# EAGLE design main v0.04 (EAGLE 6.3)
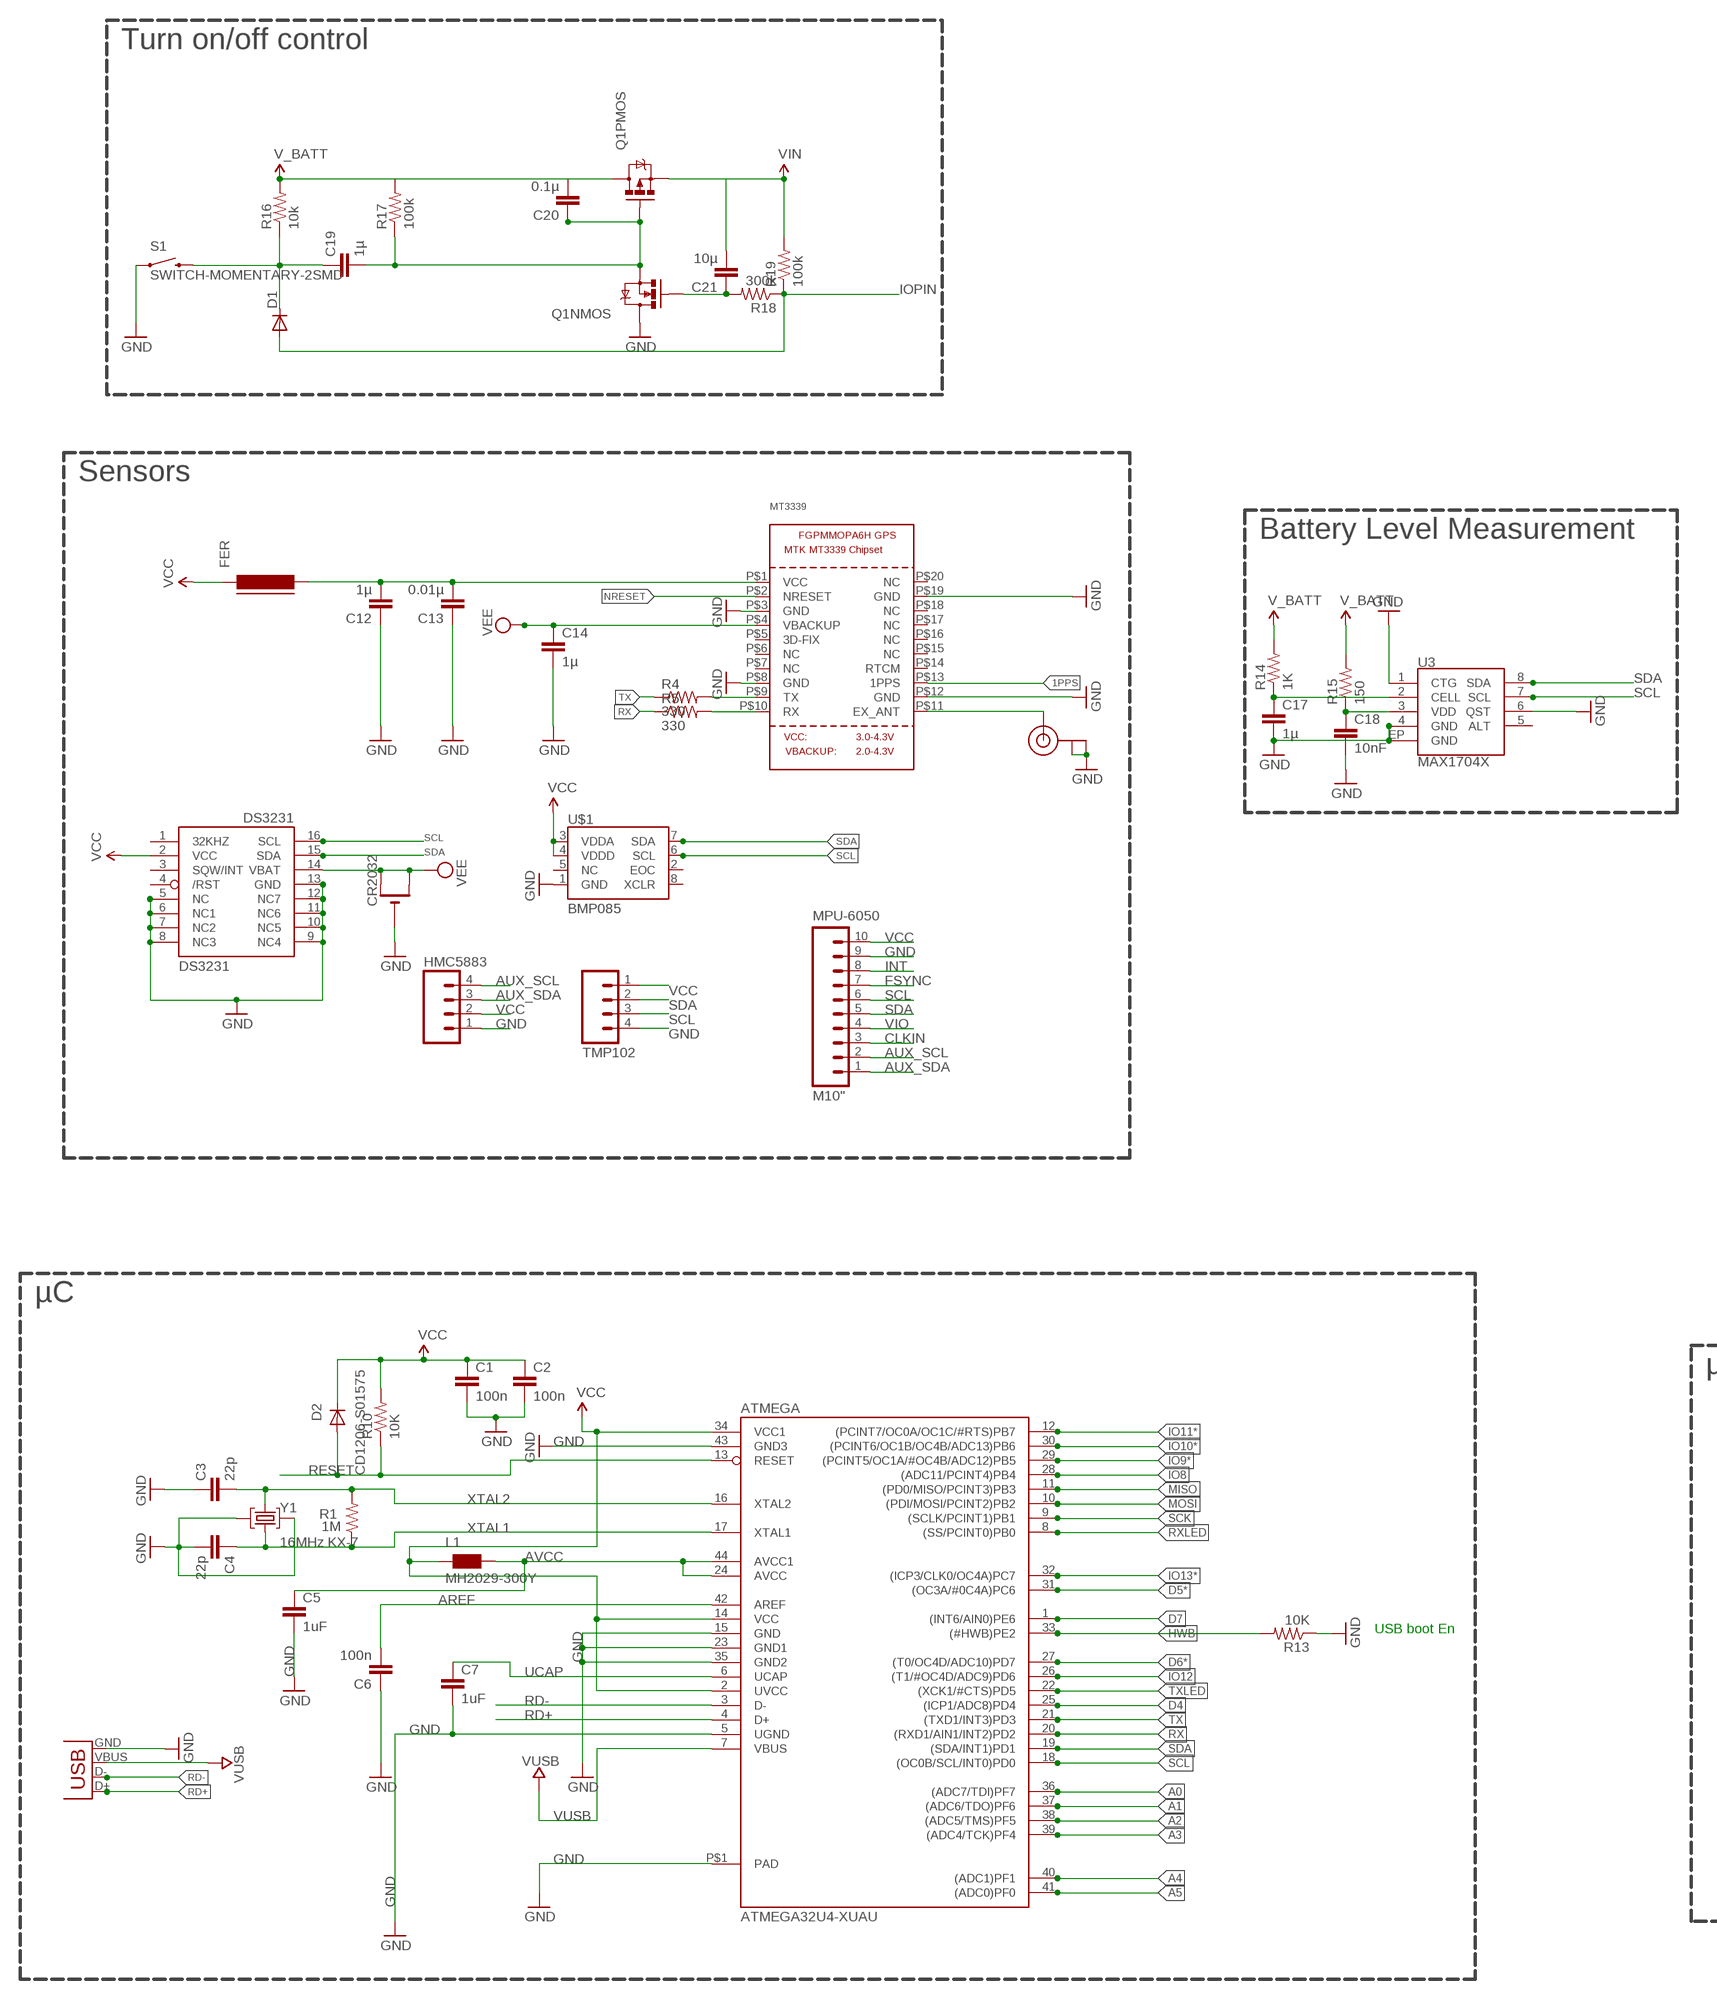
[diagram p0: schematic, sheet 1, part 1 of 2]
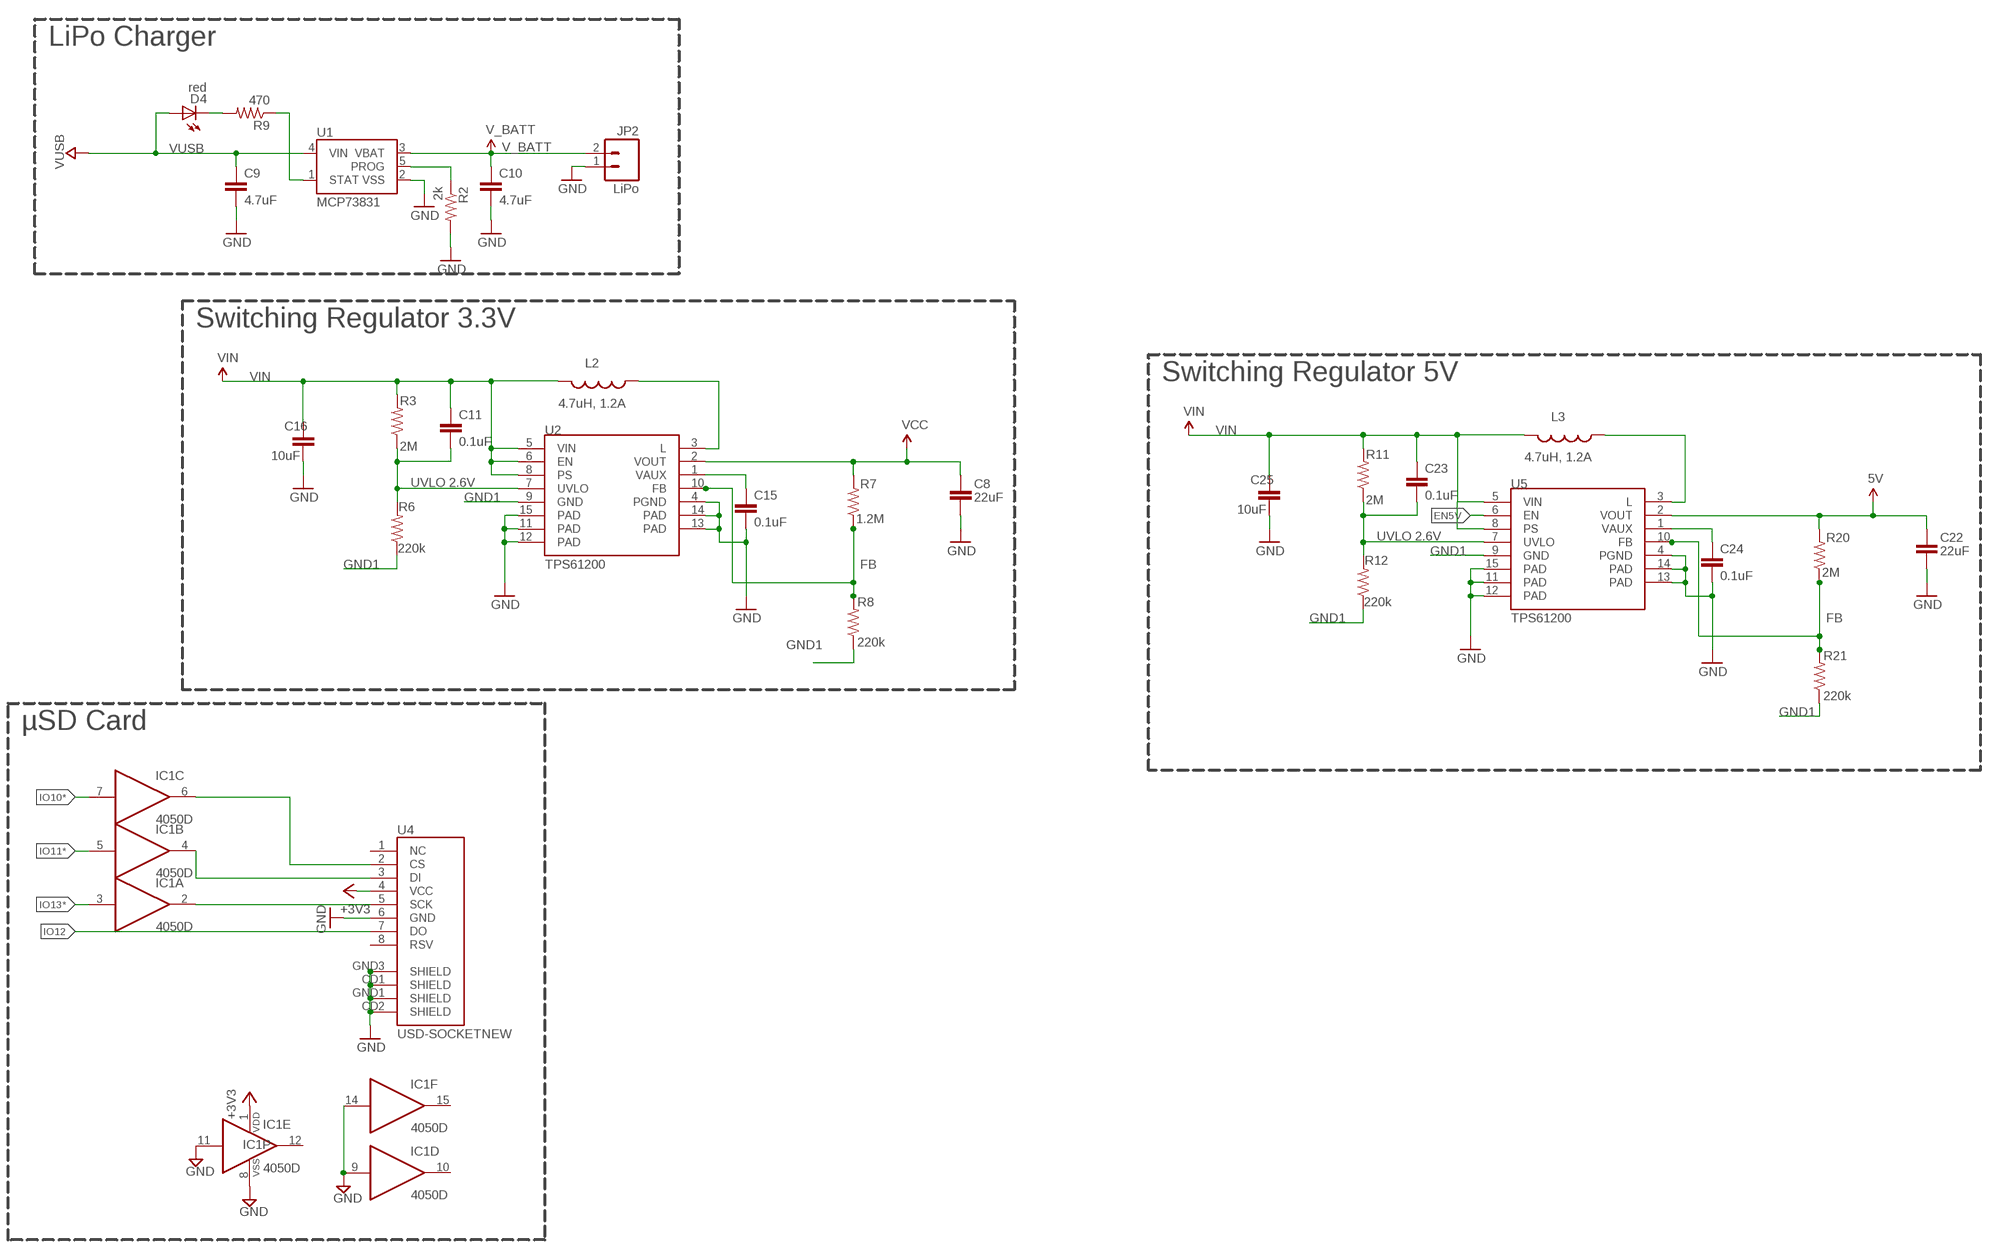
[diagram p1: schematic, sheet 1, part 2 of 2]

## Parts
ATMEGA  ATMEGA32U4-XUAU  [TQFP44-PAD]
C1  100n  CAP0805  [0805]
C2  100n  CAP0805  [0805]
C3  22p  CAP0805  [0805]
C4  22p  CAP0805  [0805]
C5  1uF  CAP0805  [0805]
C6  100n  CAP0805  [0805]
C7  1uF  CAP0805  [0805]
C8  22uF  CAP0805  [0805]
C9  4.7uF  CAP0805  [0805]
C10  4.7uF  CAP0805  [0805]
C11  0.1uF  CAP0805  [0805]
C12  1µ  CAP0805  [0805]
C13  0.01µ  CAP0805  [0805]
C14  1µ  CAP0805  [0805]
C15  0.1uF  CAP0805  [0805]
C16  10uF  CAP0805  [0805]
C17  1µ  CAP0805  [0805]
C18  10nF  CAP0805  [0805]
C19  1µ  CAP0805  [0805]
C20  0.1µ  CAP0805  [0805]
C21  10µ  CAP0805  [0805]
C22  22uF  CAP0805  [0805]
C23  0.1uF  CAP0805  [0805]
C24  0.1uF  CAP0805  [0805]
C25  10uF  CAP0805  [0805]
CR2032  CR2032SMT  [CR2032-SMD]
D1  DIODEHV  [DIODE-HV]
D2  CD1206-S01575  DIODE-MINIMELF  [MINIMELF]
D4  red  LED1206  [LED-1206]
DS3231  DS3231/SO  [SO16W]
FER  FERRITE-1206  [FB1206]
HMC5883  M04PTH  [1X04]
IC1  4050D  [SO16]
JP2  LiPo  M02-JST-2MM-SMT  [JST-2-SMD]
L1  MH2029-300Y  WE-CBF_0805  [0805]
L2  4.7uH, 1.2A  INDUCTOR.  [CDRH2D09]
L3  4.7uH, 1.2A  INDUCTOR.  [CDRH2D09]
MPU-6050  M10"  [1X10]
MT3339  GPS_FGPMMOPA6H  [FGPMMOPA6H]
Q1  IRF7509  [MSOP8]
R1  1M  RESISTOR0805-RES  [0805]
R2  2k  RESISTOR0805-RES  [0805]
R3  2M  RESISTOR0805-RES  [0805]
R4  330  RESISTOR0805-RES  [0805]
R5  330  RESISTOR0805-RES  [0805]
R6  220k  RESISTOR0805-RES  [0805]
R7  1.2M  RESISTOR0805-RES  [0805]
R8  220k  RESISTOR0805-RES  [0805]
R9  470  RESISTOR0805-RES  [0805]
R10  10K  RESISTOR0805-RES  [0805]
R11  2M  RESISTOR0805-RES  [0805]
R12  220k  RESISTOR0805-RES  [0805]
R13  10K  RESISTOR0805-RES  [0805]
R14  1K  RESISTOR0805-RES  [0805]
R15  150  RESISTOR0805-RES  [0805]
R16  10k  RESISTOR0805-RES  [0805]
R17  100k  RESISTOR0805-RES  [0805]
R18  300k  RESISTOR0805-RES  [0805]
R19  100k  RESISTOR0805-RES  [0805]
R20  2M  RESISTOR0805-RES  [0805]
R21  220k  RESISTOR0805-RES  [0805]
S1  SWITCH-MOMENTARY-2SMD  [TACTILE_SWITCH_SMD]
TMP102  M04PTH  [1X04]
U1  MCP73831  [SOT23-5]
U2  TPS61200  [QFN-10_PAD]
U3  MAX1704X  [TDFN-8]
U4  USD-SOCKETNEW  [MICRO-SD-SOCKET-PP]
U5  TPS61200  [QFN-10_PAD]
U$1  BMP085  [BMP085]
U$3  U.FL  [U.FL]
X1  USB-MICROB  [USB-MICROB]
Y1  16MHz KX-7  CRYSTAL-3.2-2.5  [CRYSTAL-3.2-2.5]

## Nets
1PPS: MT3339.P$13(1PPS)
5V: C22.1 R20.2 U5.2(VOUT)
+3V3: IC1.1(P:VDD) U4.4(VCC)
A0: ATMEGA.36((ADC7/TDI)PF7)
A1: ATMEGA.37((ADC6/TDO)PF6)
A2: ATMEGA.38((ADC5/TMS)PF5)
A3: ATMEGA.39((ADC4/TCK)PF4)
A4: ATMEGA.40((ADC1)PF1)
A5: ATMEGA.41((ADC0)PF0)
AREF: ATMEGA.42(AREF) C6.2
AUX_SCL: HMC5883.4 MPU-6050.2
AUX_SDA: HMC5883.3 MPU-6050.1
AVCC: ATMEGA.24(AVCC) ATMEGA.44(AVCC1) C5.1 L1.2
CLKIN: MPU-6050.3
D4: ATMEGA.25((ICP1/ADC8)PD4)
D5*: ATMEGA.31((OC3A/#0C4A)PC6)
D6*: ATMEGA.27((T0/OC4D/ADC10)PD7)
D7: ATMEGA.1((INT6/AIN0)PE6)
EN5V: U5.6(EN)
FB: R7.1 R8.2 R20.1 R21.2 U2.10(FB) U5.10(FB)
FSYNC: MPU-6050.7
GND: ATMEGA.5(UGND) ATMEGA.15(GND) ATMEGA.23(GND1) ATMEGA.35(GND2) ATMEGA.43(GND3) ATMEGA.P$1(PAD) C1.2 C2.2 C3.1 C4.2 C5.2 C6.1 C7.2 C8.2 C9.2 C10.2 C12.1 C13.1 C14.2 C15.2 C16.2 C17.2 C18.2 C22.2 C24.2 C25.2 CR2032.- DS3231.5(NC) DS3231.6(NC1) DS3231.7(NC2) DS3231.8(NC3) DS3231.9(NC4) DS3231.10(NC5) DS3231.11(NC6) DS3231.12(NC7) DS3231.13(GND) HMC5883.1 IC1.8(P:VSS) IC1.9(D:I) IC1.11(E:I) IC1.14(F:I) JP2.1 MPU-6050.9 MT3339.P$3(GND) MT3339.P$8(GND) MT3339.P$12(GND) MT3339.P$19(GND) Q1.7(NMOS:D) Q1.8(NMOS:D) R2.2 R13.1 S1.1 TMP102.4 U1.2(VSS) U2.4(PGND) U2.11(PAD) U2.12(PAD) U2.13(PAD) U2.14(PAD) U2.15(PAD) U3.1(CTG) U3.4(GND) U3.6(QST) U3.EP(GND) U4.6(GND) U4.CD1(SHIELD) U4.CD2(SHIELD) U4.GND1(SHIELD) U4.GND3(SHIELD) U5.4(PGND) U5.11(PAD) U5.12(PAD) U5.13(PAD) U5.14(PAD) U5.15(PAD) U$1.1(GND) U$3.P$1(GND) U$3.P$2(GND) X1.GND Y1.2(GND) Y1.4(GND)
GND1: R6.1 R8.1 R12.1 R21.1 U2.9(GND) U5.9(GND)
HWB: ATMEGA.33((#HWB)PE2) R13.2
INT: MPU-6050.8
IO8: ATMEGA.28((ADC11/PCINT4)PB4)
IO9*: ATMEGA.29((PCINT5/OC1A/#OC4B/ADC12)PB5)
IO10*: ATMEGA.30((PCINT6/OC1B/OC4B/ADC13)PB6) IC1.7(C:I)
IO11*: ATMEGA.12((PCINT7/OC0A/OC1C/#RTS)PB7) IC1.5(B:I)
IO12: ATMEGA.26((T1/#OC4D/ADC9)PD6) U4.7(DO)
IO13*: ATMEGA.32((ICP3/CLK0/OC4A)PC7) IC1.3(A:I)
IOPIN: D1.A R18.1 R19.1
MISO: ATMEGA.11((PD0/MISO/PCINT3)PB3)
MOSI: ATMEGA.10((PDI/MOSI/PCINT2)PB2)
N$1: MT3339.P$11(EX_ANT) U$3.P$3(SIGNAL)
N$2: D4.C R9.2
N$3: L2.P$1 U2.3(L)
N$4: C15.1 U2.1(VAUX)
N$5: C17.1 R14.1 U3.2(CELL)
N$6: IC1.4(B:O) U4.3(DI)
N$7: MT3339.P$9(TX) R4.2
N$8: MT3339.P$10(RX) R5.2
N$9: C12.2 C13.2 FER.2 MT3339.P$1(VCC)
N$10: C18.1 R15.1 U3.3(VDD)
N$11: R2.1 U1.5(PROG)
N$12: IC1.2(A:O) U4.5(SCK)
N$13: IC1.6(C:O) U4.2(CS)
N$14: R9.1 U1.1(STAT)
N$15: C21.1 Q1.2(NMOS:G) R18.2
N$16: L3.P$1 U5.3(L)
N$17: C24.1 U5.1(VAUX)
N$18: C19.1 D1.C R16.1 S1.3
N$20: C19.2 C20.1 Q1.1(NMOS:S) Q1.4(PMOS:G) R17.1
NRESET: MT3339.P$2(NRESET)
RD+: ATMEGA.4(D+) X1.D+
RD-: ATMEGA.3(D-) X1.D-
RESET: ATMEGA.13(RESET) D2.A R10.1
RX: ATMEGA.20((RXD1/AIN1/INT2)PD2) R5.1
RXLED: ATMEGA.8((SS/PCINT0)PB0)
SCK: ATMEGA.9((SCLK/PCINT1)PB1)
SCL: ATMEGA.18((OC0B/SCL/INT0)PD0) DS3231.16(SCL) MPU-6050.6 TMP102.3 U3.7(SCL) U$1.6(SCL)
SDA: ATMEGA.19((SDA/INT1)PD1) DS3231.15(SDA) MPU-6050.5 TMP102.2 U3.8(SDA) U$1.7(SDA)
TX: ATMEGA.21((TXD1/INT3)PD3) R4.1
TXLED: ATMEGA.22((XCK1/#CTS)PD5)
UCAP: ATMEGA.6(UCAP) C7.1
UVLO: C11.2 R3.1 R6.2 U2.7(UVLO)
UVLO1: C23.2 R11.1 R12.2 U5.7(UVLO)
V_BATT: C10.1 C20.2 JP2.2 Q1.5(PMOS:D) Q1.6(PMOS:D) R14.2 R15.2 R16.2 R17.2 U1.3(VBAT)
VCC: ATMEGA.2(UVCC) ATMEGA.14(VCC) ATMEGA.34(VCC1) C1.1 C2.1 C8.1 D2.C DS3231.2(VCC) FER.1 HMC5883.2 L1.1 MPU-6050.10 R7.2 R10.2 TMP102.1 U2.2(VOUT) U$1.3(VDDA) U$1.4(VDDD)
VEE: C14.1 CR2032.+$1(+) CR2032.+$2(+1) DS3231.14(VBAT) MT3339.P$4(VBACKUP)
VIN: C11.1 C16.1 C21.2 C23.1 C25.1 L2.P$2 L3.P$2 Q1.3(PMOS:S) R3.2 R11.2 R19.2 U2.5(VIN) U2.6(EN) U2.8(PS) U5.5(VIN) U5.8(PS)
VIO: MPU-6050.4
VUSB: ATMEGA.7(VBUS) C9.1 D4.A U1.4(VIN) X1.VBUS
XTAL1: ATMEGA.17(XTAL1) C4.1 R1.1 Y1.1(C1)
XTAL2: ATMEGA.16(XTAL2) C3.2 R1.2 Y1.3(C2)
Unconnected: DS3231.1(32KHZ) DS3231.3(SQW/INT) DS3231.4(/RST) IC1.10(D:O) IC1.12(E:O) IC1.15(F:O) MT3339.P$5(3D-FIX) MT3339.P$6(NC) MT3339.P$7(NC) MT3339.P$14(RTCM) MT3339.P$15(NC) MT3339.P$16(NC) MT3339.P$17(NC) MT3339.P$18(NC) MT3339.P$20(NC) U3.5(ALT) U4.1(NC) U4.8(RSV) U$1.2(EOC) U$1.5(NC) U$1.8(XCLR)

## Notes on the sheet
- Turn on/off control
- Sensors
- Battery Level Measurement
- LiPo Charger
- Switching Regulator 3.3V
- Switching Regulator 5V
- UVLO 2.6V
- UVLO 2.6V
- µC
- µSD Card
- USB boot En

## Library data of the parts
ATMEGA = SmartPrj:ATMEGA32U4-XU
C1-C18 C22-C25 = SparkFun:CAP: Capacitor Standard 0603 ceramic capacitor, and 0.1" leaded capacitor.
C19-C21 = SparkFun-Passives:CAP: Capacitor Standard 0603 ceramic capacitor, and 0.1" leaded capacitor.
CR2032 = adafruit:CR2032
D1 = SparkFun-DiscreteSemi:DIODE: Diode These are standard reverse protection diodes and small signal diodes. SMA package can handle up to about 1A. SOD-323 can handle about 200mA. What the SOD-323 package when ordering, there are some mfgs out there that are 5-pin packages.
D2 = diode:DIODE-: DIODE
D4 = SparkFun:LED: LEDs Standard schematic elements and footprints for 5mm, 3mm, 1206, and 0603 sized LEDs. 5mm - Spark Fun Electronics SKU : COM-00529 (and others)
DS3231 = adafruit:DS3231
FER = dp_devices:FERRITE: Ferrite bead in various packages
HMC5883 TMP102 = SparkFun:M04: Header 4 Standard 4-pin 0.1" header. Use with straight break away headers (SKU : PRT-00116), right angle break away headers (PRT-00553), swiss pins (PRT-00743), machine pins (PRT-00117), and female headers (PRT-00115). Molex polarized connector foot print use with SKU : PRT-08231 with associated crimp pins and housings. 1MM SMD Version SKU: PRT-10208
IC1 = 40xx:4050: Hex non-inverting BUFFER
JP2 = SparkFun:M02: Header 2 Standard 2-pin 0.1" header. Use with straight break away headers (SKU : PRT-00116), right angle break away headers (PRT-00553), swiss pins (PRT-00743), machine pins (PRT-00117), and female headers (PRT-00115). Molex polarized connector foot print use with SKU : PRT-08233 with associated crimp pins and housings.
L1 = wuerth-elektronik:WE-CBF: SMD EMI Suppression Ferrite Beads - excellent anti-EMI properties - low DCR - impedances till 3000 ohms - rated current up to 6 A
L2 L3 = SparkFun:INDUCTOR: Inductors Basic Inductor/Choke - 0603 and 1206. Footprints are not proven and vary greatly between part numbers.
MPU-6050 = SparkFun:M10: Header 10 Standard 10-pin 0.1" header. Use with straight break away headers (SKU : PRT-00116), right angle break away headers (PRT-00553), swiss pins (PRT-00743), machine pins (PRT-00117), and female headers (PRT-00115).
MT3339 = adafruit:GPS_FGPMMOPA6H: GPS Module - MTK MT3339 Chipset, -165dBm sensitivity, 22 channels, 10Hz, auto-select external antenna options
Q1 = SparkFun-DiscreteSemi:IRF7509: 30V Dual PMOS/NMOS MSOP-8 NMOS RDS .11-ohm PMOS RDS .20-ohm
R1-R15 R20 R21 = SparkFun:RESISTOR: Resistor Basic schematic elements and footprints for 0603, 1206, and PTH resistors.
R16-R19 = SparkFun-Passives:RESISTOR: Resistor Basic schematic elements and footprints for 0603, 1206, and PTH resistors.
S1 = SparkFun-Electromechanical:SWITCH-MOMENTARY-2: Various NO switches- pushbuttons, reed, etc
U1 = SparkFun:MCP73831: Microchip's MCP73831 Miniature single cell, fully integrated Li-Ion, Li-polymer charge management controller http://ww1.microchip.com/downloads/en/DeviceDoc/21984a.pdf
U2 U5 = SparkFun:TPS61200: DC to DC Booster
U3 = SparkFun-PowerIC:MAX1704X: MAX17043/MAX17044: Battery Fuel Guage (43 is 1cell, 44 is 2cell)
U4 = SparkFun-Connectors:USD-SOCKET: microSD Socket Push-push type uSD socket. Schematic element and footprint production proven. Spark Fun Electronics SKU : PRT-00127. tDoc lines correctly indicate media card edge positions when inserting (unlocked, locked, depressed).
U$1 = SparkFun:BMP085: BMP085 Pressure Sensor Great little MEMS pressure sensor. SKU: COM-09603
U$3 = SparkFun:U.FL
X1 = SparkFun:USB: USB Connectors USB-B-PTH is fully proven SKU : PRT-00139 USB-miniB is fully proven SKU : PRT-00587 USB-A-PCB is untested. USB-A-H is throughly reviewed, but untested. Spark Fun Electronics SKU : PRT-00437 USB-B-SMT is throughly reviewed, but untested. Needs silkscreen touching up. USB-A-S has not been used/tested USB-MB-H has not been used/tested
Y1 = SmartPrj:CRYSTAL-3.2-2.5

## Board
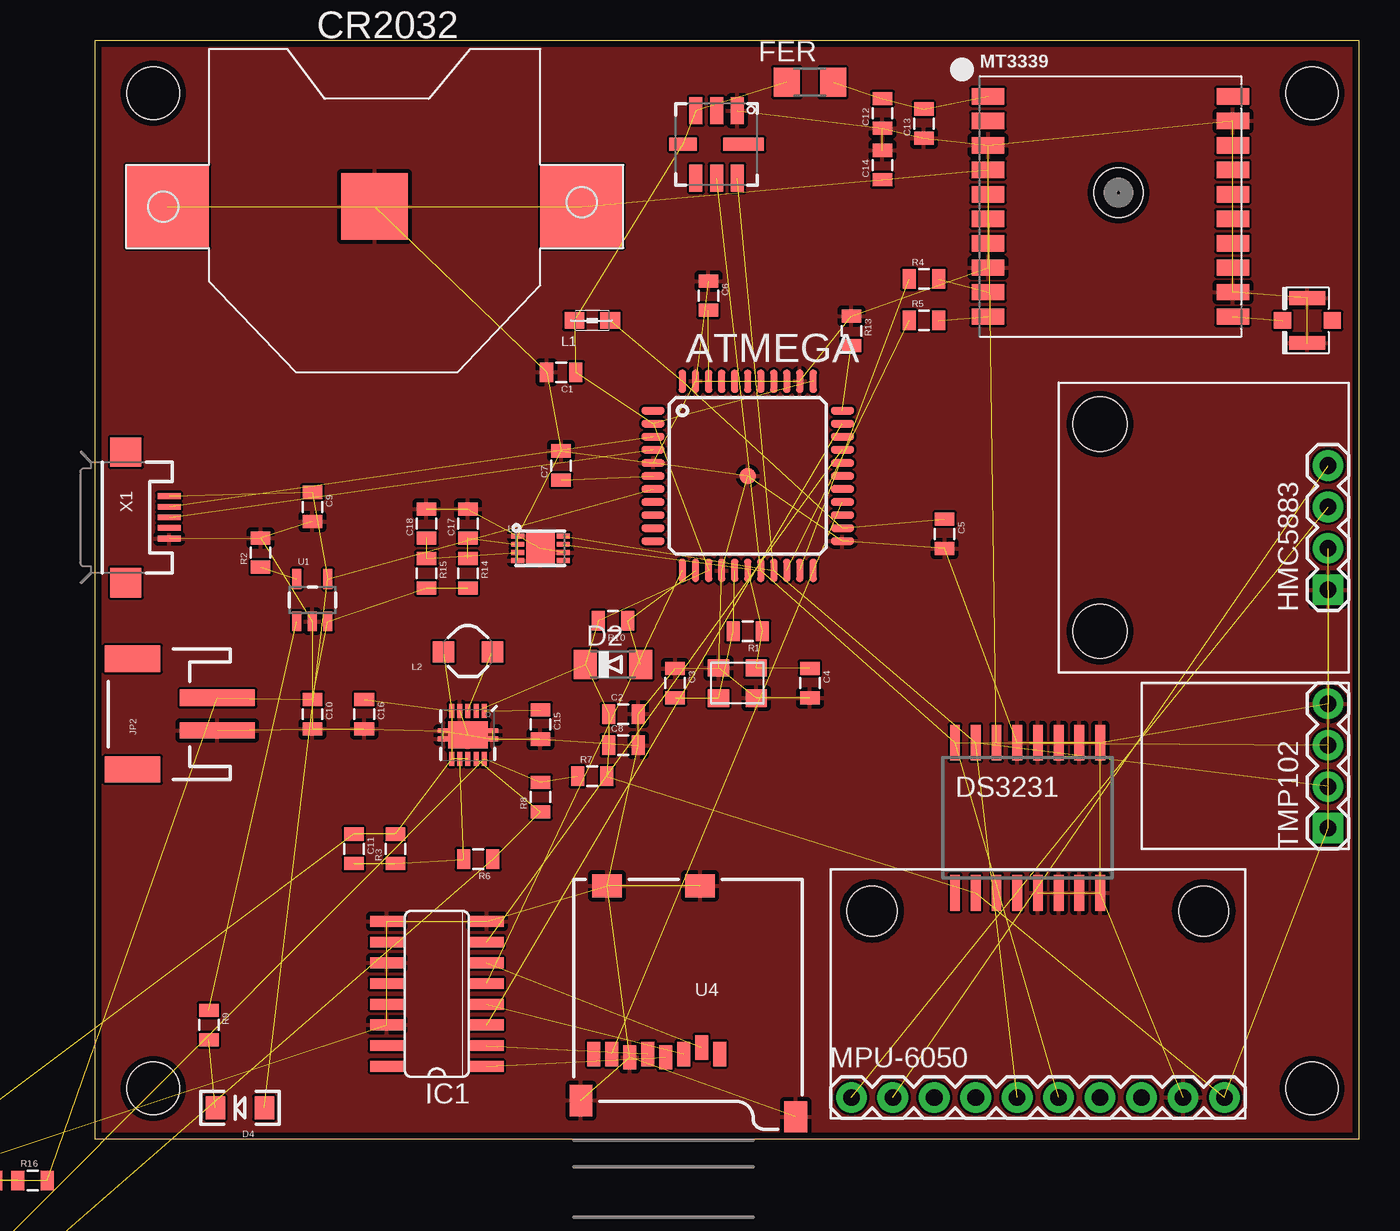
[diagram p2: board, top side]
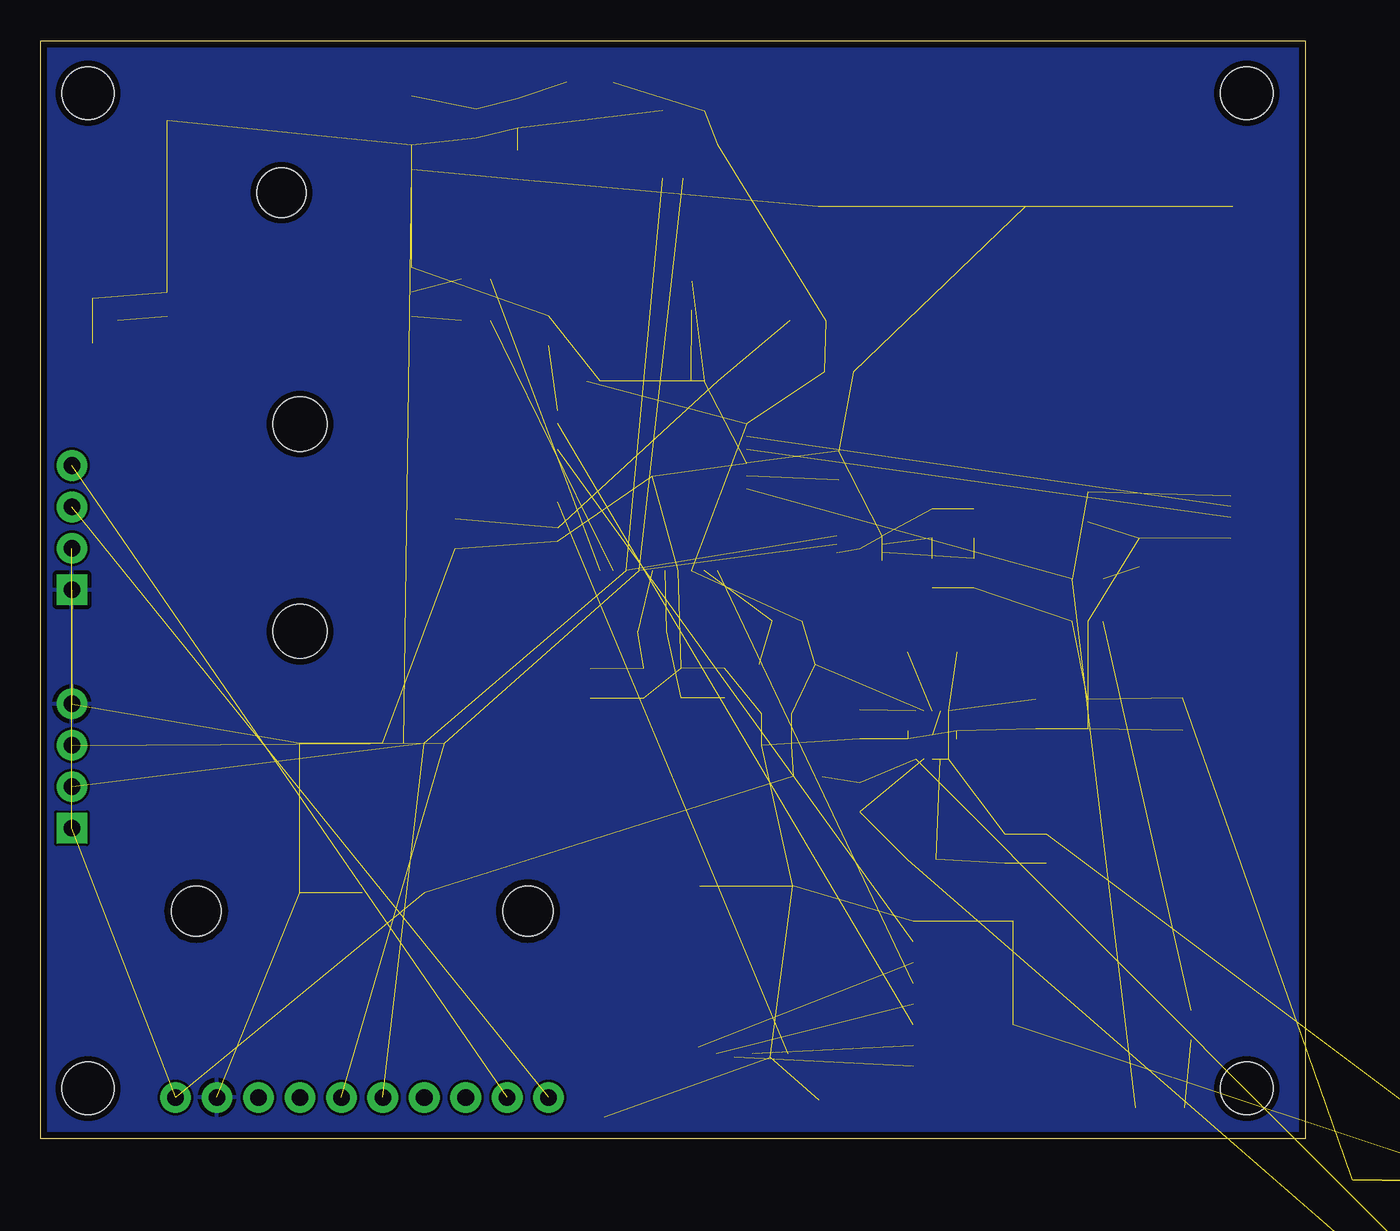
[diagram p3: board, bottom side, seen from below]

Size 77.47 x 67.31 mm. Coordinates in mm from the lower left corner, seen from the top.
Outline: 0,0 77.47,0 77.47,67.31 0,67.31 0,0
Copper layers (1*16): Top 0.0356mm / dielectric 1.5011mm / Bottom 0.0356mm
Design rules "LaenPCBOrder": minimum track width 6mil, minimum drill 13mil, track to track 6mil, track to pad 6mil, pad to pad 6mil, via to via 6mil, smd to smd 6mil, copper to edge 15mil, drill to drill 6mil, minimum pad ring 7mil, minimum via ring 7mil, stop-mask expansion 4mil, vias tented up to drill 0mil, thermal gap 10mil
Holes 3.2 mm at 3.58,64.09 3.58,3.1 74.58,3.1 74.58,64.09

### Footprints (pad centres in the part's own frame; a part is rotated, then mirrored left to right if it is on the bottom)
TQFP44-PAD = smd 1.4 x 0.45: 1 -5.8,4; 2 -5.8,3.2; 3 -5.8,2.4; 4 -5.8,1.6; 5 -5.8,0.8; 6 -5.8,0; 7 -5.8,-0.8; 8 -5.8,-1.6; 9 -5.8,-2.4; 10 -5.8,-3.2; 11 -5.8,-4; 23 5.8,-4; 24 5.8,-3.2; 25 5.8,-2.4; 26 5.8,-1.6; 27 5.8,-0.8; 28 5.8,0; 29 5.8,0.8; 30 5.8,1.6; 31 5.8,2.4; 32 5.8,3.2; 33 5.8,4 | smd 0.45 x 1.4: 12 -4,-5.8; 13 -3.2,-5.8; 14 -2.4,-5.8; 15 -1.6,-5.8; 16 -0.8,-5.8; 17 0,-5.8; 18 0.8,-5.8; 19 1.6,-5.8; 20 2.4,-5.8; 21 3.2,-5.8; 22 4,-5.8; 34 4,5.8; 35 3.2,5.8; 36 2.4,5.8; 37 1.6,5.8; 38 0.8,5.8; 39 0,5.8; 40 -0.8,5.8; 41 -1.6,5.8; 42 -2.4,5.8; 43 -3.2,5.8; 44 -4,5.8 | smd 1 x 1: P$1 0,0
0805 = smd 0.8 x 1.2: 1 -0.9,0; 2 0.9,0
CR2032-SMD = smd 5.08 x 5.08: +$1 -12.7,0; +$2 12.7,0 | smd 4.064 x 4.064: - 0,0
DIODE-HV = smd 2.2 x 2.4: A 2.454,0; C -2.454,0
MINIMELF = smd 1.4 x 1.8: A 1.7,0; C -1.7,0
LED-1206 = smd 1.2 x 1.4: A -1.5,0; C 1.5,0
SO16W = smd 0.6 x 2.2: 1 -4.445,-4.6; 2 -3.175,-4.6; 3 -1.905,-4.6; 4 -0.635,-4.6; 5 0.635,-4.6; 6 1.905,-4.6; 7 3.175,-4.6; 8 4.445,-4.6; 9 4.445,4.6; 10 3.175,4.6; 11 1.905,4.6; 12 0.635,4.6; 13 -0.635,4.6; 14 -1.905,4.6; 15 -3.175,4.6; 16 -4.445,4.6
FB1206 = smd 1.6 x 1.803: 1 -1.422,0; 2 1.422,0
1X04 = drill 1.016 pad 1.88 square: 1 0,0 | drill 1.016 pad 1.88: 2 2.54,0; 3 5.08,0; 4 7.62,0
SO16 = smd 0.66 x 2.032: 1 -4.445,-3.073; 2 -3.175,-3.073; 3 -1.905,-3.073; 4 -0.635,-3.073; 5 0.635,-3.073; 6 1.905,-3.073; 7 3.175,-3.073; 8 4.445,-3.073; 9 4.445,3.073; 10 3.175,3.073; 11 1.905,3.073; 12 0.635,3.073; 13 -0.635,3.073; 14 -1.905,3.073; 15 -3.175,3.073; 16 -4.445,3.073
STAND-OFF = hole 3.302: 0,0
JST-2-SMD = smd 1 x 4.6: 1 -1,-3.7; 2 1,-3.7 | smd 1.6 x 3.4: NC1 -3.4,1.5; NC2 3.4,1.5
STAND-OFF-TIGHT = hole 3.048: 0,0
0805' = smd 1.2 x 1: 1 -1.1,0; 2 1.1,0
CDRH2D09 = smd 1.3 x 1.3: P$1 -1.5,0; P$2 1.5,0
1X10 = drill 1.016 pad 1.88: 1 0,0; 2 2.54,0; 3 5.08,0; 4 7.62,0; 5 10.16,0; 6 12.7,0; 7 15.24,0; 8 17.78,0; 9 20.32,0; 10 22.86,0
FGPMMOPA6H = smd 2 x 1: P$1 -7.5,6.75; P$2 -7.5,5.25; P$3 -7.5,3.75; P$4 -7.5,2.25; P$5 -7.5,0.75; P$6 -7.5,-0.75; P$7 -7.5,-2.25; P$8 -7.5,-3.75; P$9 -7.5,-5.25; P$10 -7.5,-6.75; P$11 7.5,-6.75; P$12 7.5,-5.25; P$13 7.5,-3.75; P$14 7.5,-2.25; P$15 7.5,-0.75; P$16 7.5,0.75; P$17 7.5,2.25; P$18 7.5,3.75; P$19 7.5,5.25; P$20 7.5,6.75 | hole 3: 0.5,0.85
MSOP8 = smd 0.4 x 1.1: 1 -0.975,-2.25; 2 -0.325,-2.25; 3 0.325,-2.25; 4 0.975,-2.25; 5 0.975,2.25; 6 0.325,2.25; 7 -0.325,2.25; 8 -0.975,2.25
TACTILE_SWITCH_SMD = smd 1.524 x 0.762: 1 -2.54,1.905; 2 2.54,1.905; 3 -2.54,-1.905; 4 2.54,-1.905
SOT23-5 = smd 0.55 x 1.2: 1 -0.95,-1.3; 2 0,-1.3; 3 0.95,-1.3; 4 0.95,1.3; 5 -0.95,1.3
QFN-10_PAD = smd 0.297 x 0.85: 1 -1,-1.475; 2 -0.5,-1.475; 3 0,-1.475; 4 0.5,-1.475; 5 1,-1.475; 6 1,1.475; 7 0.5,1.475; 8 0,1.475; 9 -0.5,1.475; 10 -1,1.475 | smd 0.7 x 0.28: 11 -1.5,0.25; 12 -1.5,-0.25; 13 1.5,0.25; 14 1.5,-0.25 | smd 2.4 x 1.65: 15 0,0
TDFN-8 = smd 0.8 x 0.3: 1 -1.4,0.75; 2 -1.4,0.25; 3 -1.4,-0.25; 4 -1.4,-0.75; 5 1.4,-0.75; 6 1.4,-0.25; 7 1.4,0.25; 8 1.4,0.75 | smd 1.73 x 1.88: EP 0,0
MICRO-SD-SOCKET-PP = smd 0.8 x 1.5: 1 -8.94,10.7; 2 -7.84,10.3; 3 -6.74,10.7; 4 -5.64,10.9; 5 -4.54,10.7; 6 -3.44,10.9; 7 -2.34,10.7; 8 -1.24,10.7 | smd 1.8 x 1.4: CD1 -2.05,0.4; CD2 -7.75,0.4 | smd 1.4 x 1.9: GND1 -13.6,14.55; GND3 -0.45,13.55
BMP085 = smd 1.67 x 0.8: 1 -2.065,1.27; 2 -2.065,0; 3 -2.065,-1.27; 5 2.065,-1.27; 6 2.065,0; 7 2.065,1.27 | smd 0.8 x 1.67: 4 0,-2.065 | smd 0.8 x 2.5: 8 0,1.65
U.FL = smd 2.2 x 0.85: P$1 0,1.375; P$2 0,-1.375 | smd 1.05 x 1: P$3 1.525,0; P$4 -1.525,0
USB-MICROB = smd 0.35 x 1.4: D+ 0,2.65; D- -0.65,2.65; GND 1.3,2.65; ID 0.65,2.65; VBUS -1.3,2.65 | smd 1.8 x 1.9: MT1 -4,0; MT2 4,0
CRYSTAL-3.2-2.5 = smd 1.3 x 1.05: 1 -1.15,-0.925; 2 1.15,-0.925; 3 1.15,0.925; 4 -1.15,0.925

### Placement (x,y rotation side)
ATMEGA  40.01,40.64 0 top
C1  28.57,46.99 180 top
C2  32.38,26.04 0 top
C3  35.56,27.94 270 top
C4  43.81,27.94 270 top
C5  52.07,37.08 270 top
C6  37.59,51.69 270 top
C7  28.57,41.27 90 top
C8  32.38,24.13 0 top
C9  13.34,38.73 270 top
C10  13.34,26.04 270 top
C11  15.88,17.78 270 top
C12  48.26,62.87 90 top
C13  50.8,62.23 90 top
C14  48.26,59.69 90 top
C15  27.3,25.4 270 top
C16  16.51,26.04 270 top
C17  22.86,37.72 90 top
C18  20.32,37.72 90 top
C19  -16.51,-2.54 0 top  (outside the outline)
C20  -19.68,-2.54 0 top  (outside the outline)
C21  -22.86,-2.54 0 top  (outside the outline)
C22  -13.34,-29.21 0 top  (outside the outline)
C23  -22.86,-33.02 0 top  (outside the outline)
C24  -19.68,-33.02 0 top  (outside the outline)
C25  -16.51,-33.02 0 top  (outside the outline)
CR2032  17.14,57.15 0 top
D1  -19.68,-15.24 0 top  (outside the outline)
D2  31.75,29.08 0 top
D4  8.89,1.91 180 top
DS3231  57.15,19.68 0 top
FER  43.81,64.77 0 top
HMC5883  75.56,33.66 90 top
IC1  20.95,8.89 90 top
JP1  STAND-OFF  [STAND-OFF]  61.59,31.11 90 top
JP2  3.81,26.04 90 top
JP5  STAND-OFF  [STAND-OFF]  61.59,43.81 90 top
JP7  STAND-OFFTIGHT  [STAND-OFF-TIGHT]  67.94,13.97 270 top
JP8  STAND-OFFTIGHT  [STAND-OFF-TIGHT]  47.62,13.97 270 top
L1  MH2029-300Y  [0805']  30.48,50.16 0 top
L2  22.86,29.84 180 top
L3  -21.59,-29.21 0 top  (outside the outline)
MPU-6050  46.35,2.54 0 top
MT3339  62.23,57.15 0 top
Q1  -20.95,-8.26 0 top  (outside the outline)
R1  40.01,31.11 180 top
R2  10.16,35.94 90 top
R3  18.41,17.78 90 top
R4  50.8,52.7 0 top
R5  50.8,50.16 0 top
R6  23.5,17.14 180 top
R7  30.48,22.23 0 top
R8  27.3,20.95 90 top
R9  6.99,6.99 270 top
R10  31.75,31.75 180 top
R11  -13.34,-33.02 0 top  (outside the outline)
R12  -22.86,-36.83 0 top  (outside the outline)
R13  46.35,49.53 270 top
R14  22.86,34.67 270 top
R15  20.32,34.67 270 top
R16  -3.81,-2.54 0 top
R17  -6.99,-2.54 0 top  (outside the outline)
R18  -10.16,-2.54 0 top  (outside the outline)
R19  -13.34,-2.54 0 top  (outside the outline)
R20  -19.68,-36.83 0 top  (outside the outline)
R21  -16.51,-36.83 0 top  (outside the outline)
S1  -20.32,-20.32 0 top  (outside the outline)
TMP102  75.56,19.05 90 top
U1  13.34,33.02 0 top
U2  22.86,24.77 180 top
U3  27.3,36.2 0 top
U4  29.34,15.9 180 top
U5  -22.23,-25.4 0 top  (outside the outline)
U$1  38.1,60.96 270 top
U$3  74.3,50.16 180 top
X1  1.91,38.1 270 top
Y1  39.37,27.94 180 top

### Tracks (layer width: path | path; a pad name or v marks a point on that pad's centre or on a via)
5V  (2 unrouted)
+3V3  (1 unrouted)
AREF  (1 unrouted)
AUX_SCL  (1 unrouted)
AUX_SDA  (1 unrouted)
AVCC  (3 unrouted)
FB  (5 unrouted)
GND  (80 unrouted)
  pour Top: 0,0 77.47,0 77.47,67.31 0,67.31
  pour Bottom: 0,0 77.47,0 77.47,67.31 0,67.31
GND1  (5 unrouted)
HWB  (1 unrouted)
IO10*  (1 unrouted)
IO11*  (1 unrouted)
IO12  (1 unrouted)
IO13*  (1 unrouted)
IOPIN  (2 unrouted)
N$1  (1 unrouted)
N$2  (1 unrouted)
N$3  (1 unrouted)
N$4  (1 unrouted)
N$5  (2 unrouted)
N$6  (1 unrouted)
N$7  (1 unrouted)
N$8  (1 unrouted)
N$9  (3 unrouted)
N$10  (2 unrouted)
N$11  (1 unrouted)
N$12  (1 unrouted)
N$13  (1 unrouted)
N$14  (1 unrouted)
N$15  (2 unrouted)
N$16  (1 unrouted)
N$17  (1 unrouted)
N$18  (3 unrouted)
N$20  (4 unrouted)
RD+  (1 unrouted)
RD-  (1 unrouted)
RESET  (2 unrouted)
RX  (1 unrouted)
SCL  (5 unrouted)
SDA  (5 unrouted)
TX  (1 unrouted)
UCAP  (1 unrouted)
UVLO  (3 unrouted)
UVLO1  (3 unrouted)
V_BATT  (9 unrouted)
VCC  (17 unrouted)
VEE  (4 unrouted)
VIN  (15 unrouted)
VUSB  (4 unrouted)
XTAL1  (3 unrouted)
XTAL2  (3 unrouted)